# Altium schematic sheet obc-v2_CM4-CSI.SchDoc
size 420 x 297 mm; SheetNumber: 18; SheetTotal: 21
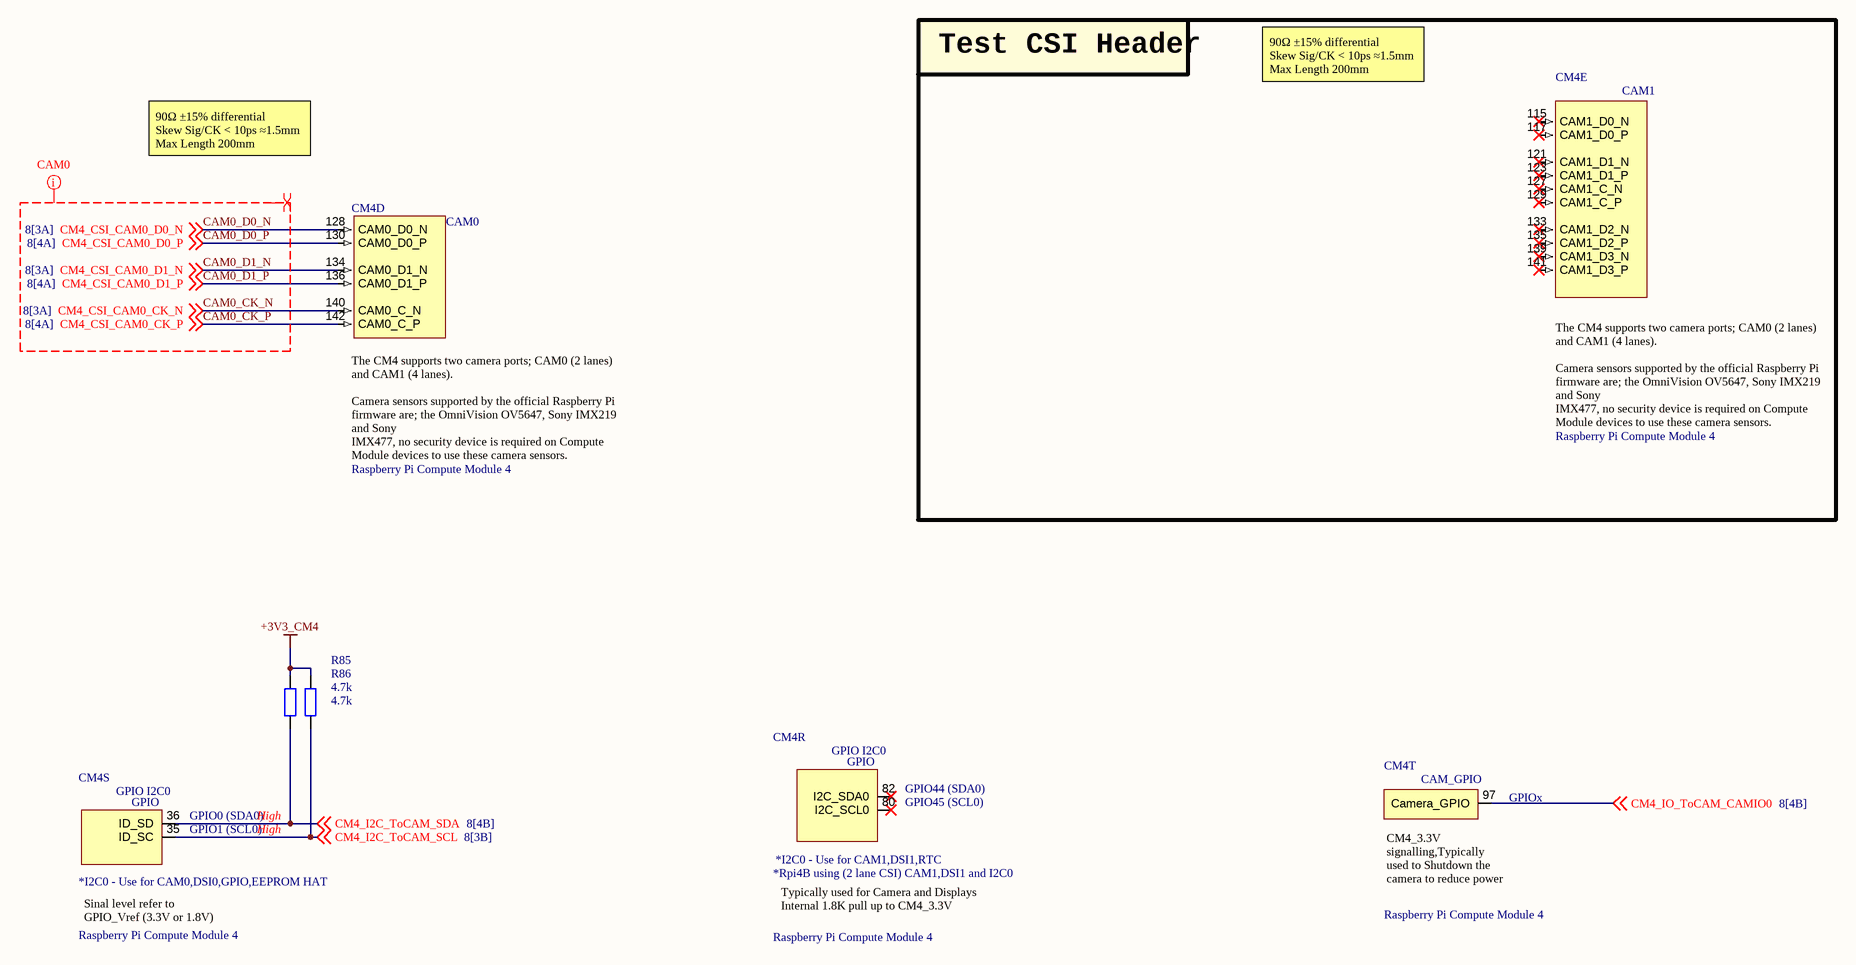
[diagram p0: obc-v2_CM4-CSI.SchDoc]

## Parts
CM4  Raspberry Pi Compute Module 4  [CM4-DF40HC(3.0)-100DS-0.4v_3mm_1.5mm]  (parts D,E,R,S,T of 21)  (no BOM)
R85  4.7k  [RES_C_1608X60]
R86  4.7k  [RES_C_1608X60]

## Blocks framed on the sheet
Test CSI Header: CM4

## Nets
+3V3_CM4: R85.1 R86.1
CAM0_CK_N: CM4.140(CAM0_C_N) ; off-sheet CM4_CSI_CAM0_CK_N  [also labelled CM4_CSI_CAM0_CK_N]
CAM0_CK_P: CM4.142(CAM0_C_P) ; off-sheet CM4_CSI_CAM0_CK_P  [also labelled CM4_CSI_CAM0_CK_P]
CAM0_D0_N: CM4.128(CAM0_D0_N) ; off-sheet CM4_CSI_CAM0_D0_N  [also labelled CM4_CSI_CAM0_D0_N]
CAM0_D0_P: CM4.130(CAM0_D0_P) ; off-sheet CM4_CSI_CAM0_D0_P  [also labelled CM4_CSI_CAM0_D0_P]
CAM0_D1_N: CM4.134(CAM0_D1_N) ; off-sheet CM4_CSI_CAM0_D1_N  [also labelled CM4_CSI_CAM0_D1_N]
CAM0_D1_P: CM4.136(CAM0_D1_P) ; off-sheet CM4_CSI_CAM0_D1_P  [also labelled CM4_CSI_CAM0_D1_P]
CM4_I2C_ToCAM_SCL: CM4.35(ID_SC) R86.2 ; off-sheet CM4_I2C_ToCAM_SCL
CM4_I2C_ToCAM_SDA: CM4.36(ID_SD) R85.2 ; off-sheet CM4_I2C_ToCAM_SDA
CM4_IO_ToCAM_CAMIO0: CM4.97(Camera_GPIO) ; off-sheet CM4_IO_ToCAM_CAMIO0

Not connected (* = marked no-connect by the designer): CM4 80(I2C_SCL0)* 82(I2C_SDA0)* 115(CAM1_D0_N)* 117(CAM1_D0_P)* 121(CAM1_D1_N)* 123(CAM1_D1_P)* 127(CAM1_C_N)* 129(CAM1_C_P)* 133(CAM1_D2_N)* 135(CAM1_D2_P)* 139(CAM1_D3_N)* 141(CAM1_D3_P)*

## Layout directives
differential pair; differential pair class DIFF100: CAM0_CK_N, CAM0_CK_P, CAM0_D0_N, CAM0_D0_P, CAM0_D1_N, CAM0_D1_P, CM4_CSI_CAM0_CK_N, CM4_CSI_CAM0_CK_P, CM4_CSI_CAM0_D0_N, CM4_CSI_CAM0_D0_P, CM4_CSI_CAM0_D1_N, CM4_CSI_CAM0_D1_P
net class CAM0: CAM0_CK_N, CAM0_CK_P, CAM0_D0_N, CAM0_D0_P, CAM0_D1_N, CAM0_D1_P, CM4_CSI_CAM0_CK_N, CM4_CSI_CAM0_CK_P, CM4_CSI_CAM0_D0_N, CM4_CSI_CAM0_D0_P, CM4_CSI_CAM0_D1_N, CM4_CSI_CAM0_D1_P

## Notes on the sheet
- 90Ω ±15% differential
  Skew Sig/CK < 10ps ≈1.5mm
  Max Length 200mm
- Project:
- Sub-system:
- Design by:
- Sheet title:
- Sheet
- A3
- of
- Checked by:
- Approved by:
- Revision:
- Document No:
- Size:
- Date:
- (in symbol CM4, part D) CAM0; The CM4 supports two camera ports; CAM0 (2 lanes) and CAM1 (4 lanes). / Camera sensors supported by the official Raspberry Pi firmware are; the OmniVision OV5647, Sony IMX219 and Sony / IMX477, no security device is required on Compute Module devices to use these camera sensors.
- (in symbol CM4, part E) CAM1; The CM4 supports two camera ports; CAM0 (2 lanes) and CAM1 (4 lanes). / Camera sensors supported by the official Raspberry Pi firmware are; the OmniVision OV5647, Sony IMX219 and Sony / IMX477, no security device is required on Compute Module devices to use these camera sensors.
- (in symbol CM4, part R) GPIO I2C0; GPIO; GPIO44 (SDA0); GPIO45 (SCL0); *I2C0 - Use for CAM1,DSI1,RTC; *Rpi4B using (2 lane CSI) CAM1,DSI1 and I2C0; Typically used for Camera and Displays Internal 1.8K pull up to CM4_3.3V
- (in symbol CM4, part S) GPIO I2C0; GPIO; GPIO0 (SDA0); High; GPIO1 (SCL0); *I2C0 - Use for CAM0,DSI0,GPIO,EEPROM HAT; Sinal level refer to  GPIO_Vref (3.3V or 1.8V)
- (in symbol CM4, part T) CAM_GPIO; GPIOx; CM4_3.3V signalling,Typically used to Shutdown the camera to reduce power

## Library data of the parts
CM4 = CM4: Raspberry Pi Compute Module 4 by Amornthep Phunsin
R85 R86 = Tro 0603 1% 10k: RES; Chung_Loai: Dán; Don_Vi: Con; So_Chan: 2; Ten_Linh_Kien: Trở 0603 1% 10k; Ma_Hang: MH006333; Kieu_Chan: *